# EAGLE design Prototype V0.2 (EAGLE 9.3.1)
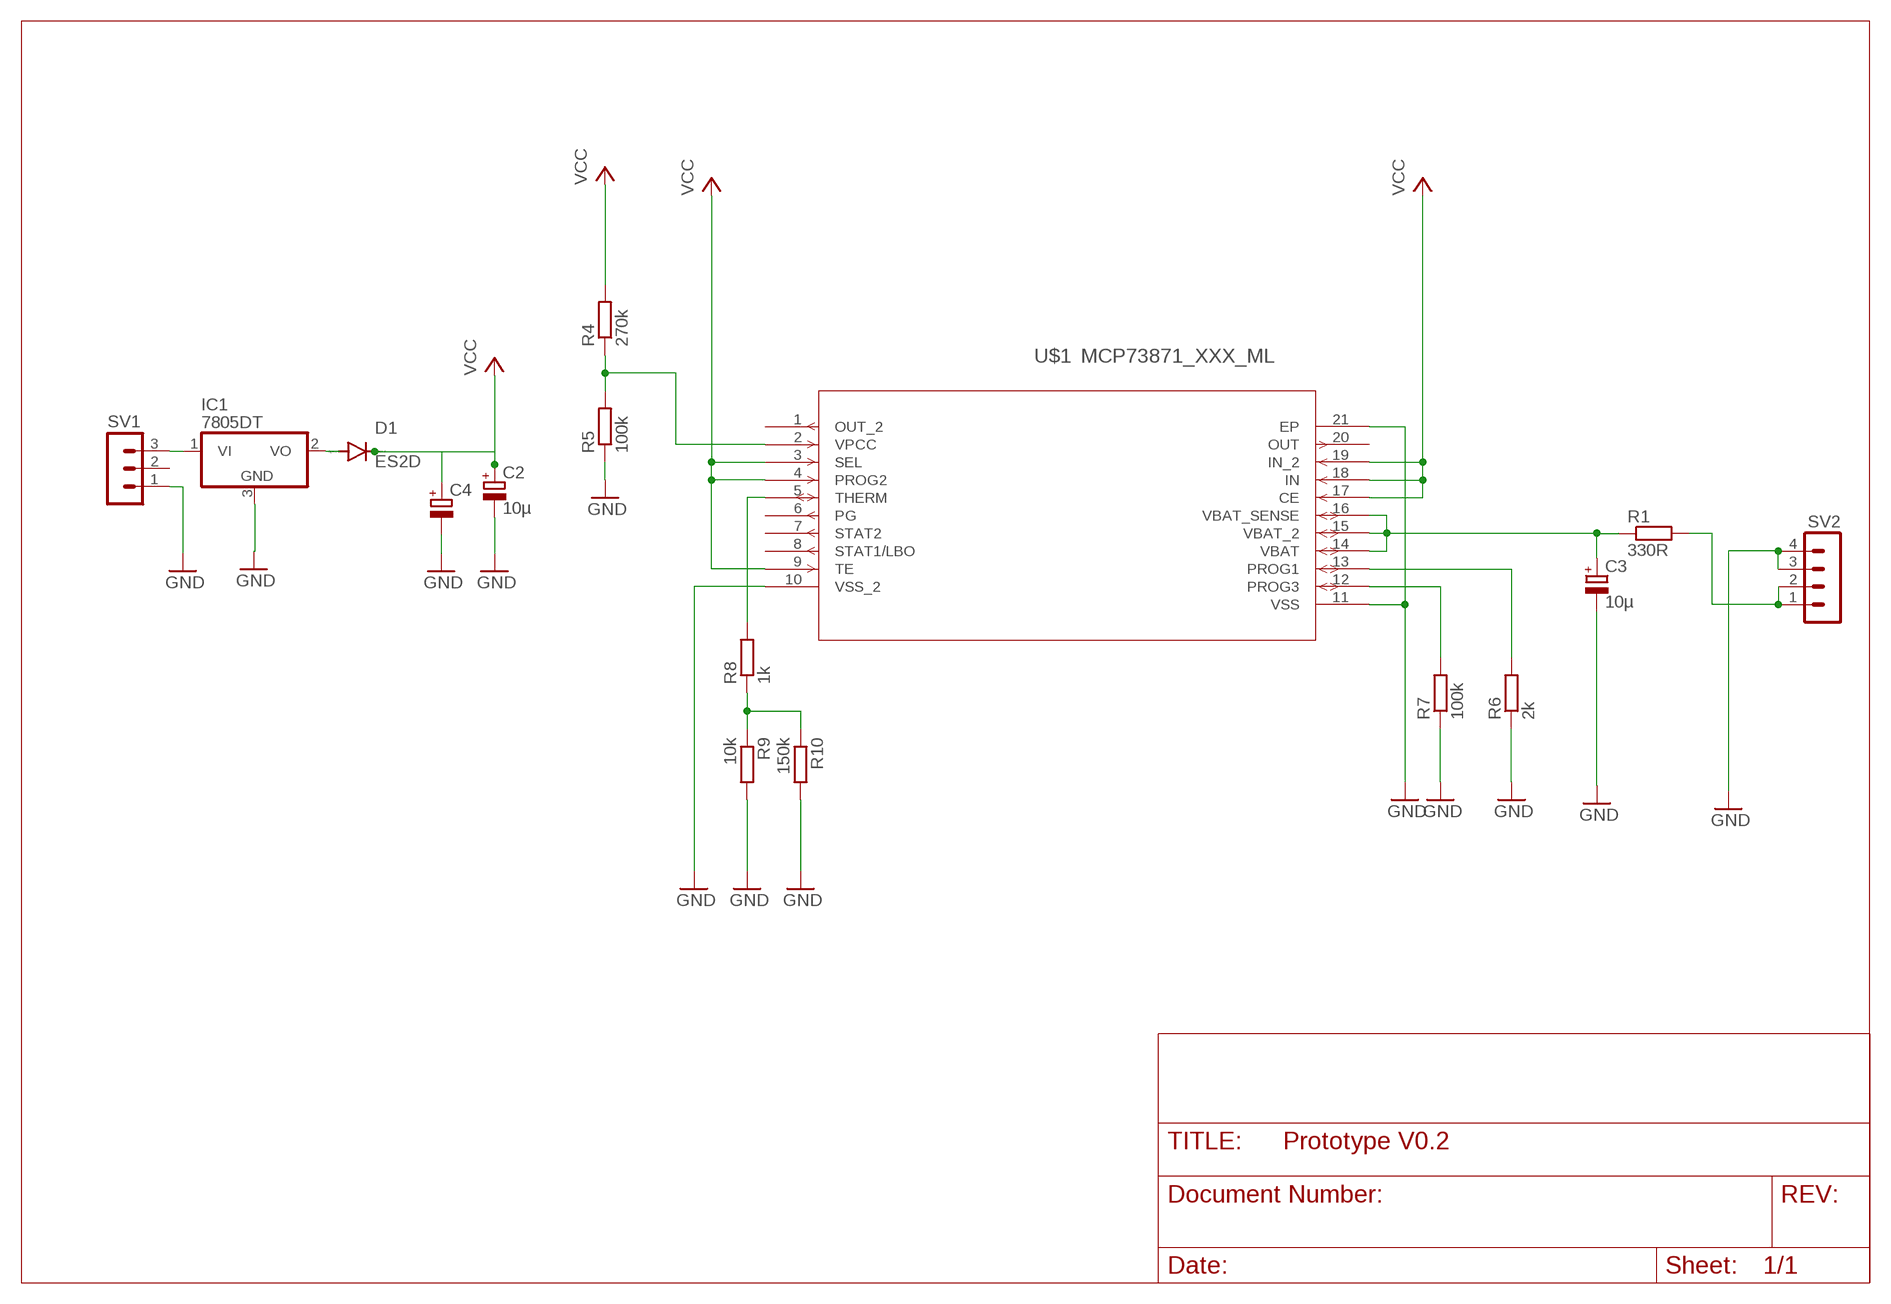
[diagram p0: schematic, sheet 1]

## Parts
C2  10µ  CPOL-EU153CLV-0505  [153CLV-0505]
C3  10µ  CPOL-EU153CLV-0505  [153CLV-0505]
C4  CPOL-EUE2.5-6  [E2,5-6]
D1  ES2D  [SMB]
IC1  7805DT  [TO252]
R1  330R  R-EU_R0603  [R0603]
R4  270k  R-EU_R0603  [R0603]
R5  100k  R-EU_R0603  [R0603]
R6  2k  R-EU_R0603  [R0603]
R7  100k  R-EU_R0603  [R0603]
R8  1k  R-EU_R0603  [R0603]
R9  10k  R-EU_R0603  [R0603]
R10  150k  R-EU_R0603  [R0603]
SV1  MA03-1  [MA03-1]
SV2  MA04-1  [MA04-1]
U$1  MCP73871_XXX_ML  [QFN20_4X4MC]

## Nets
GND: C2.- C3.- C4.- IC1.3(GND) R5.1 R6.1 R7.1 R9.2 R10.2 SV1.1 SV2.3 SV2.4 U$1.10(VSS_2) U$1.11(VSS) U$1.21(EP)
N$1: R1.2 SV2.1 SV2.2
N$2: R1.1
N$3: IC1.1(VI) SV1.3
N$4: D1.A IC1.2(VO)
N$7: R4.1 R5.2 U$1.2(VPCC)
N$8: R7.2 U$1.12(PROG3)
N$9: R8.1 R9.1 R10.1
N$10: R6.2 U$1.13(PROG1)
N$14: R8.2 U$1.5(THERM)
VCC: C2.+ C4.+ D1.C R4.2 U$1.3(SEL) U$1.4(PROG2) U$1.9(TE) U$1.17(CE) U$1.18(IN) U$1.19(IN_2)
VIN: C3.+ U$1.14(VBAT) U$1.15(VBAT_2) U$1.16(VBAT_SENSE)
Unconnected: SV1.2 U$1.1(OUT_2) U$1.6(PG) U$1.7(STAT2) U$1.8(STAT1/LBO) U$1.20(OUT)

## Library data of the parts
C2-C4 = rcl:CPOL-EU: POLARIZED CAPACITOR, European symbol; SPICEPREFIX: C
D1 = diode:ES2D: DIODE super fast rectifier, 2 A
IC1 = linear4:78*: Positive VOLTAGE REGULATOR
R1 R4-R10 = rcl:R-EU_: RESISTOR, European symbol; SPICEPREFIX: R
SV1 = con-lstb:MA03-1: PIN HEADER; OC_FARNELL: unknown; OC_NEWARK: unknown
SV2 = con-lstb:MA04-1: PIN HEADER; OC_FARNELL: unknown; OC_NEWARK: unknown
U$1 = MCP73871:MCP73871_XXX_ML

## Board
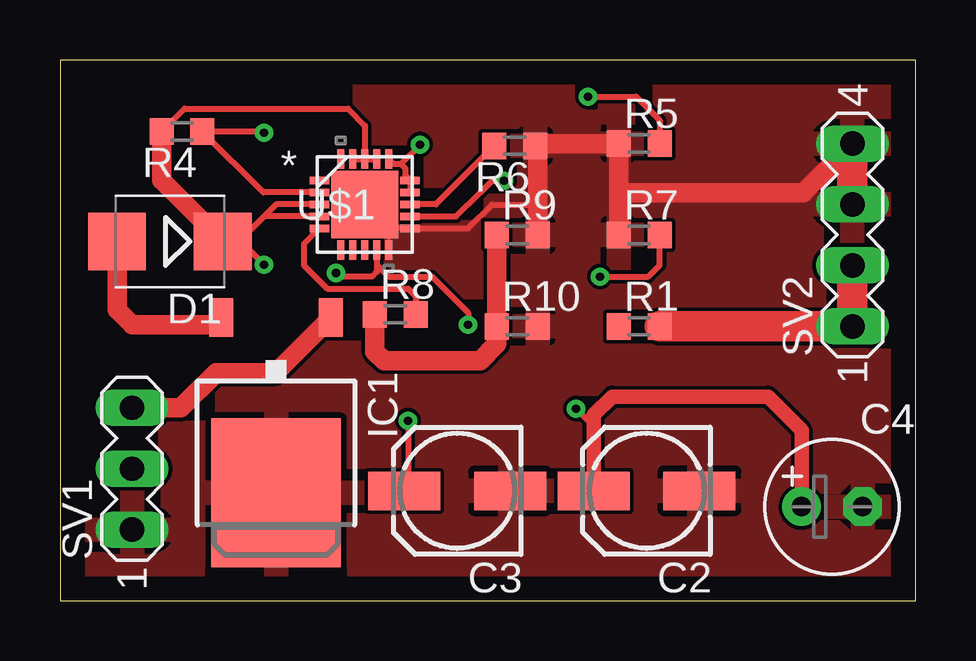
[diagram p1: board, top side]
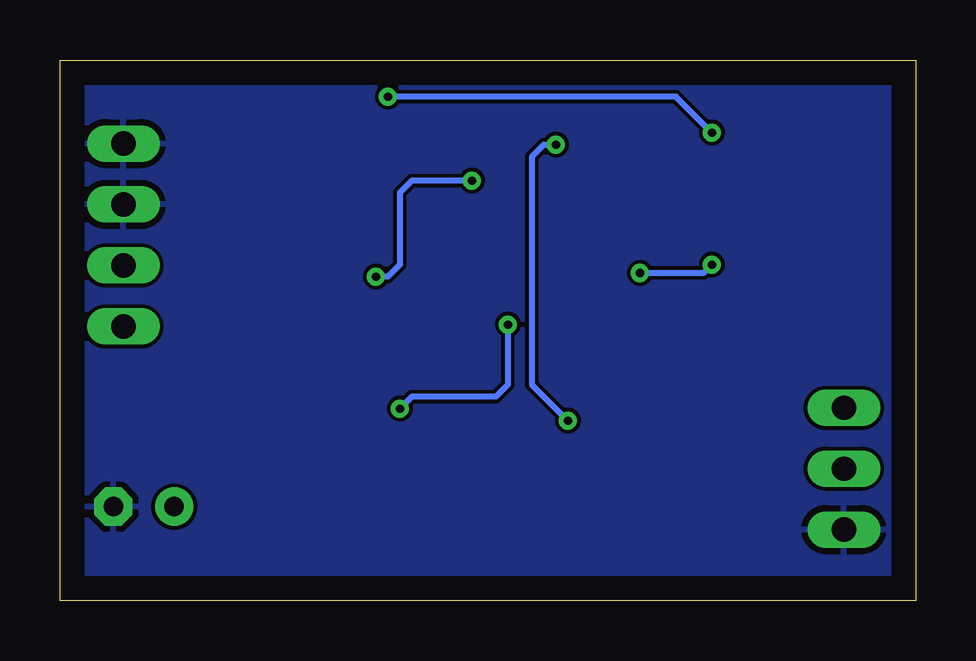
[diagram p2: board, bottom side, seen from below]

Size 35.66 x 22.53 mm. Coordinates in mm from the lower left corner, seen from the top.
Outline: 0,0 35.66,0 35.66,22.53 0,22.53 0,0
Copper layers (1*16): Top 0.035mm / dielectric 1.5mm / Bottom 0.035mm
Design rules "default": minimum track width 6mil, minimum drill 0.35mm, track to track 6mil, track to pad 6mil, pad to pad 6mil, via to via 6mil, smd to smd 6mil, copper to edge 40mil, drill to drill 6mil, minimum pad ring 10mil, minimum via ring 8mil, stop-mask expansion 4mil, vias tented up to drill 0mil, thermal gap 10mil

### Footprints (pad centres in the part's own frame; a part is rotated, then mirrored left to right if it is on the bottom)
153CLV-0505 = smd 3 x 1.6: + 2.2,0; - -2.2,0
E2,5-6 = drill 0.813 pad 1.6: + -1.27,0 | drill 0.813 pad 1.6 octagon: - 1.27,0
SMB = smd 2.4 x 2.4: A 2.2,0; C -2.2,0
TO252 = smd 1 x 1.6: 1 -2.28,-4.8; 2 2.28,-4.8 | smd 5.4 x 6.2: 3 0,2.5
R0603 = smd 1 x 1.1: 1 -0.85,0; 2 0.85,0
MA03-1 = drill 1.016 long: 1 -2.54,0; 2 0,0; 3 2.54,0
MA04-1 = drill 1.016 long: 1 -3.81,0; 2 -1.27,0; 3 1.27,0; 4 3.81,0
QFN20_4X4MC = smd 0.813 x 0.305: 1 -1.892,1; 2 -1.892,0.5; 3 -1.892,0; 4 -1.892,-0.5; 5 -1.892,-1; 11 1.892,-1; 12 1.892,-0.5; 13 1.892,0; 14 1.892,0.5; 15 1.892,1 | smd 0.305 x 0.813: 6 -1,-1.892; 7 -0.5,-1.892; 8 0,-1.892; 9 0.5,-1.892; 10 1,-1.892; 16 1,1.892; 17 0.5,1.892; 18 0,1.892; 19 -0.5,1.892; 20 -1,1.892 | smd 2.794 x 2.794: 21 0,0

### Placement (x,y rotation side)
C2  24.44,4.58 180 top
C3  16.55,4.58 180 top
C4  32.17,3.92 0 top
D1  4.58,14.97 180 top
IC1  9,7 180 top
R1  24.13,11.43 0 top
R4  5.08,19.55 180 top
R5  24.13,19.05 0 top
R6  18.95,18.95 180 top
R7  24.13,15.24 0 top
R8  13.97,11.93 0 top
R9  19.05,15.24 0 top
R10  19.05,11.43 0 top
SV1  3,5.5 90 top
SV2  33.02,15.24 90 top
U$1  12.7,16.51 0 top

### Tracks (layer width: path | path; a pad name or v marks a point on that pad's centre or on a via)
GND
  Top 0.152: U$1.10 13.7,15.51 U$1.21
  Top 0.203: U$1.11 13.7,15.51
  Top 0.254: U$1.11 17.01,15.51 18,16.5 19.9,16.5
  Top 0.813: R7.1 23.28,17 | 23.28,17 R5.1 19.9,19.05 R6.1 19.9,18.85 19.9,16.5 R9.2 | SV2.4 30.97,17 23.28,17
  Top 1.27: SV2.3 SV2.4
  pour Top: 0,0 0,22.5 35.5,22.5 35.5,0
  pour Bottom: 0,22.5 0,0 35.5,0 35.5,22.5
N$1
  Top 1.27: R1.2 SV2.1 SV2.2
N$3
  Top 0.813: SV1.3 5.04,8.04 6.5,9.5 8.98,9.5 IC1.1
N$4
  Top 0.813: D1.A 2.38,12.12 3,11.5 6.42,11.5 IC1.2
N$7  (via drill 0.35)
  Top 0.254: U$1.2 8.47,17.01 R4.1 8.45,19.55 v8.5,19.5 | v22,21 24,21 24.98,20.02 R5.2
  Bottom 0.254: v8.5,19.5 10,21 v22,21
N$8  (via drill 0.35)
  Top 0.254: U$1.12 16.51,16.01 17.5,17 18,17.5 v18.5,17.5 | v22.5,13.5 24.5,13.5 24.98,13.98 R7.2
  Bottom 0.254: v18.5,17.5 21,17.5 21.5,17 21.5,14 22,13.5 v22.5,13.5
N$9
  Top 0.813: R9.1 R10.1 18.2,10.7 17.5,10 13.5,10 13.12,10.38 R8.1
N$10
  Top 0.254: R6.2 15.66,16.51 U$1.13
N$14
  Top 0.254: U$1.5 10.16,14.86 10.16,13.97 11.13,13 14.5,13 14.82,12.68 R8.2
VCC  (via drill 0.35)
  Top 0.254: U$1.3 9,16.51 8.5,16.01 | U$1.19 U$1.18 | U$1.18 U$1.17 | R4.2 5.18,20.5 12,20.5 12.7,19.8 U$1.18 | 8.5,16.01 7.46,14.97 | 7.46,14.97 D1.C | U$1.4 8.5,16.01 | U$1.9 13.2,14 | 13.2,14 13.2,13.7 13,13.5 11.5,13.5 v11.5,13.66 | v8.5,14 7.53,14.97 7.46,14.97 | 13.2,14 13.7,13.5 15.5,13.5 17,12 v17,11.5 | v21.5,8 22.24,7.26 C2.+
  Top 0.61: C2.+ 22.24,7.74 23,8.5 29.5,8.5 30.9,7.1 C4.+
  Top 0.813: R4.2 4.23,17.52 D1.C
  Bottom 0.254: v11.5,13.66 8.84,13.66 v8.5,14 | v17,11.5 17,9 17.5,8.5 21,8.5 v21.5,8
VIN  (via drill 0.35)
  Top 0.254: U$1.16 13.92,18.19 14.19,18.19 | 14.19,18.19 14.21,18.19 14.38,18.02 14.38,17.73 U$1.15 U$1.14 | v15,19 14.19,18.19 | v14.5,7.5 14.5,4.73 C3.+
  Bottom 0.254: v15,19 15.5,19 16,18.5 16,9 v14.5,7.5